# Altium project ECU rev B.PrjPcb (part 2 of 2)

## Sheet ExternalIO.SchDoc
size A4; Organization: Altium Limited; Address1: L3, 12a Rodborough Rd; Address2: Frenchs Forest; Address3: NSW; Address4: Australia 2086
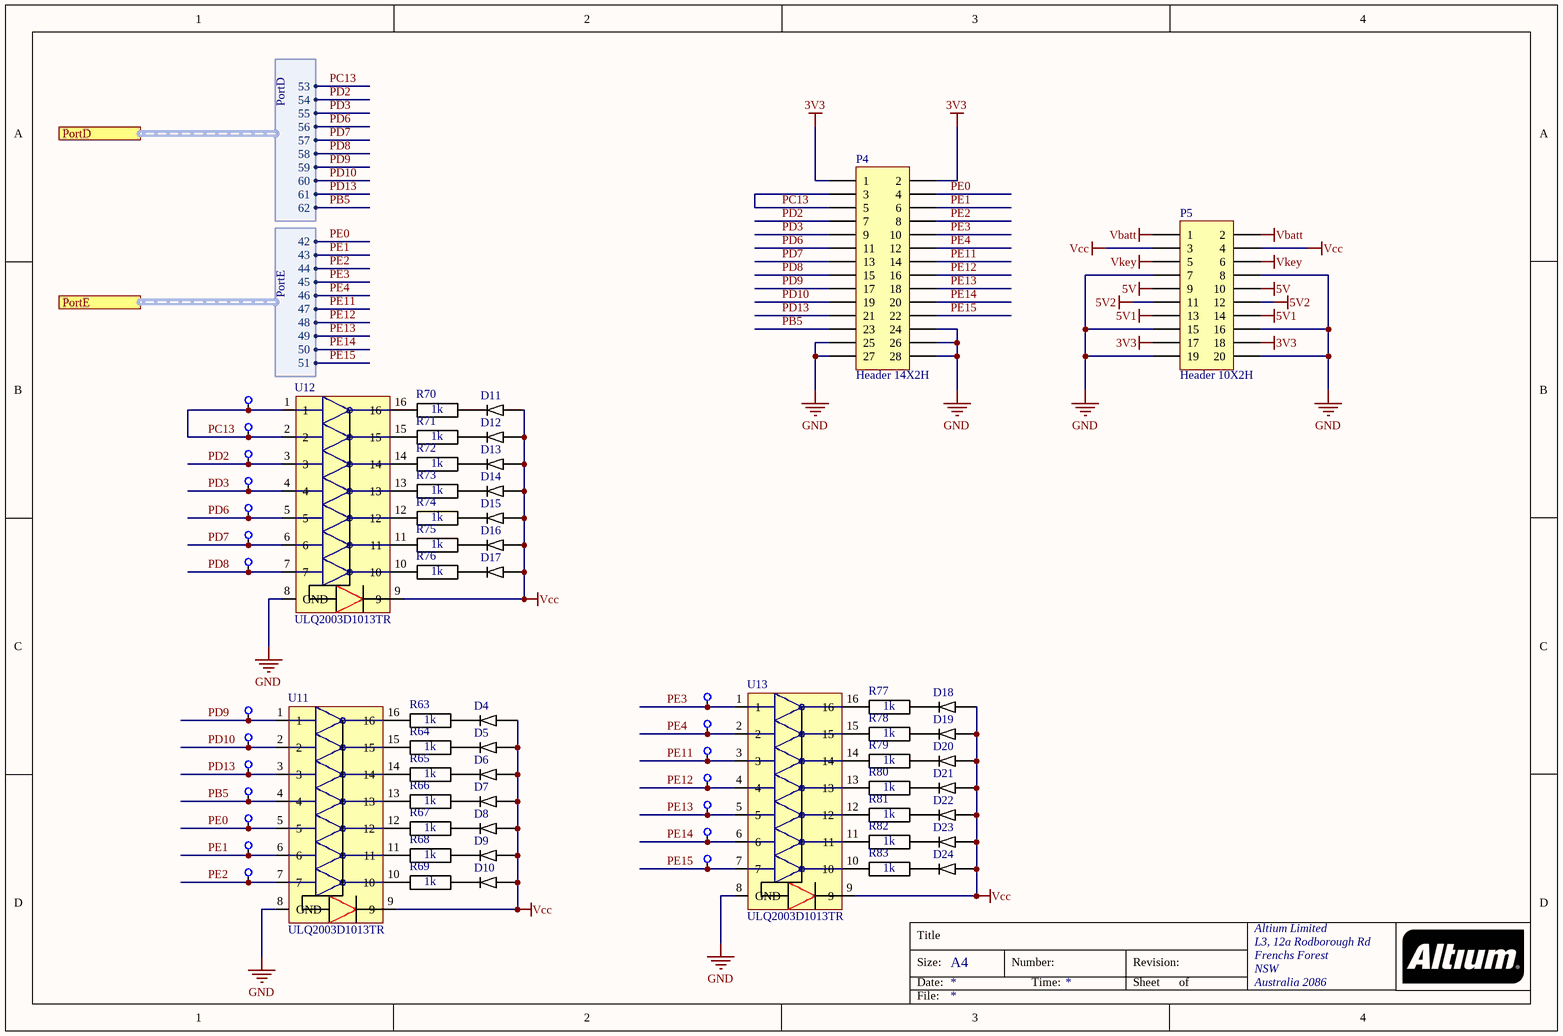
[diagram p16: ExternalIO.SchDoc]

### Parts
D4  LED  [LED 0805]  (value not drawn)
D5  LED  [LED 0805]  (value not drawn)
D6  LED  [LED 0805]  (value not drawn)
D7  LED  [LED 0805]  (value not drawn)
D8  LED  [LED 0805]  (value not drawn)
D9  LED  [LED 0805]  (value not drawn)
D10  LED  [LED 0805]  (value not drawn)
D11  LED  [LED 0805]  (value not drawn)
D12  LED  [LED 0805]  (value not drawn)
D13  LED  [LED 0805]  (value not drawn)
D14  LED  [LED 0805]  (value not drawn)
D15  LED  [LED 0805]  (value not drawn)
D16  LED  [LED 0805]  (value not drawn)
D17  LED  [LED 0805]  (value not drawn)
D18  LED  [LED 0805]  (value not drawn)
D19  LED  [LED 0805]  (value not drawn)
D20  LED  [LED 0805]  (value not drawn)
D21  LED  [LED 0805]  (value not drawn)
D22  LED  [LED 0805]  (value not drawn)
D23  LED  [LED 0805]  (value not drawn)
D24  LED  [LED 0805]  (value not drawn)
P4  Header 14X2H  [HDR2X14H]
P5  Header 10X2H  [HDR2X10H]
R63  1k  [SMD 0805]
R64  1k  [SMD 0805]
R65  1k  [SMD 0805]
R66  1k  [SMD 0805]
R67  1k  [SMD 0805]
R68  1k  [SMD 0805]
R69  1k  [SMD 0805]
R70  1k  [SMD 0805]
R71  1k  [SMD 0805]
R72  1k  [SMD 0805]
R73  1k  [SMD 0805]
R74  1k  [SMD 0805]
R75  1k  [SMD 0805]
R76  1k  [SMD 0805]
R77  1k  [SMD 0805]
R78  1k  [SMD 0805]
R79  1k  [SMD 0805]
R80  1k  [SMD 0805]
R81  1k  [SMD 0805]
R82  1k  [SMD 0805]
R83  1k  [SMD 0805]
TP69  TestPoint  [TESTPOINT]  (value not drawn)
TP70  TestPoint  [TESTPOINT]  (value not drawn)
TP71  TestPoint  [TESTPOINT]  (value not drawn)
TP72  TestPoint  [TESTPOINT]  (value not drawn)
TP73  TestPoint  [TESTPOINT]  (value not drawn)
TP74  TestPoint  [TESTPOINT]  (value not drawn)
TP75  TestPoint  [TESTPOINT]  (value not drawn)
TP76  TestPoint  [TESTPOINT]  (value not drawn)
TP77  TestPoint  [TESTPOINT]  (value not drawn)
TP78  TestPoint  [TESTPOINT]  (value not drawn)
TP79  TestPoint  [TESTPOINT]  (value not drawn)
TP80  TestPoint  [TESTPOINT]  (value not drawn)
TP81  TestPoint  [TESTPOINT]  (value not drawn)
TP82  TestPoint  [TESTPOINT]  (value not drawn)
TP83  TestPoint  [TESTPOINT]  (value not drawn)
TP84  TestPoint  [TESTPOINT]  (value not drawn)
TP85  TestPoint  [TESTPOINT]  (value not drawn)
TP86  TestPoint  [TESTPOINT]  (value not drawn)
TP87  TestPoint  [TESTPOINT]  (value not drawn)
TP88  TestPoint  [TESTPOINT]  (value not drawn)
TP89  TestPoint  [TESTPOINT]  (value not drawn)
U11  ULQ2003D1013TR  [SOIC127P600X175_HS-17M]
U12  ULQ2003D1013TR  [SOIC127P600X175_HS-17M]
U13  ULQ2003D1013TR  [SOIC127P600X175_HS-17M]

### Ports
PortD (harness PortD), PortE (harness PortE)

### Harnesses
PortD: 53, 54, 55, 56, 57, 58, 59, 60, 61, 62
PortE: 42, 43, 44, 45, 46, 47, 48, 49, 50, 51

### Nets
3V3: P4.1 P4.2 P5.17 P5.18
5V: P5.9 P5.10
5V1: P5.13 P5.14
5V2: P5.11 P5.12
GND: P4.24 P4.25 P4.26 P4.27 P4.28 P5.7 P5.8 P5.15 P5.16 P5.19 P5.20 U11.8(GND) U12.8(GND) U13.8(GND)
Vbatt: P5.1 P5.2
Vcc: D4.+ D5.+ D6.+ D7.+ D8.+ D9.+ D10.+ D11.+ D12.+ D13.+ D14.+ D15.+ D16.+ D17.+ D18.+ D19.+ D20.+ D21.+ D22.+ D23.+ D24.+ P5.3 P5.4 U11.9 U12.9 U13.9
Vkey: P5.5 P5.6
PB5: P4.23 TP79.0 U11.4 ; port PortD.62
PC13: P4.3 P4.5 TP69.0 TP70.0 U12.1 U12.2 ; port PortD.53
PD2: P4.7 TP71.0 U12.3 ; port PortD.54
PD3: P4.9 TP72.0 U12.4 ; port PortD.55
PD6: P4.11 TP73.0 U12.5 ; port PortD.56
PD7: P4.13 TP74.0 U12.6 ; port PortD.57
PD8: P4.15 TP75.0 U12.7 ; port PortD.58
PD9: P4.17 TP76.0 U11.1 ; port PortD.59
PD10: P4.19 TP77.0 U11.2 ; port PortD.60
PD13: P4.21 TP78.0 U11.3 ; port PortD.61
PE0: P4.4 TP80.0 U11.5 ; port PortE.42
PE1: P4.6 TP81.0 U11.6 ; port PortE.43
PE2: P4.8 TP82.0 U11.7 ; port PortE.44
PE3: P4.10 TP83.0 U13.1 ; port PortE.45
PE4: P4.12 TP84.0 U13.2 ; port PortE.46
PE11: P4.14 TP85.0 U13.3 ; port PortE.47
PE12: P4.16 TP86.0 U13.4 ; port PortE.48
PE13: P4.18 TP87.0 U13.5 ; port PortE.49
PE14: P4.20 TP88.0 U13.6 ; port PortE.50
PE15: P4.22 TP89.0 U13.7 ; port PortE.51
NetD4_-: D4.- R63.2
NetD5_-: D5.- R64.2
NetD6_-: D6.- R65.2
NetD7_-: D7.- R66.2
NetD8_-: D8.- R67.2
NetD9_-: D9.- R68.2
NetD10_-: D10.- R69.2
NetD11_-: D11.- R70.2
NetD12_-: D12.- R71.2
NetD13_-: D13.- R72.2
NetD14_-: D14.- R73.2
NetD15_-: D15.- R74.2
NetD16_-: D16.- R75.2
NetD17_-: D17.- R76.2
NetD18_-: D18.- R77.2
NetD19_-: D19.- R78.2
NetD20_-: D20.- R79.2
NetD21_-: D21.- R80.2
NetD22_-: D22.- R81.2
NetD23_-: D23.- R82.2
NetD24_-: D24.- R83.2
NetR63_1: R63.1 U11.16
NetR64_1: R64.1 U11.15
NetR65_1: R65.1 U11.14
NetR66_1: R66.1 U11.13
NetR67_1: R67.1 U11.12
NetR68_1: R68.1 U11.11
NetR69_1: R69.1 U11.10
NetR70_1: R70.1 U12.16
NetR71_1: R71.1 U12.15
NetR72_1: R72.1 U12.14
NetR73_1: R73.1 U12.13
NetR74_1: R74.1 U12.12
NetR75_1: R75.1 U12.11
NetR76_1: R76.1 U12.10
NetR77_1: R77.1 U13.16
NetR78_1: R78.1 U13.15
NetR79_1: R79.1 U13.14
NetR80_1: R80.1 U13.13
NetR81_1: R81.1 U13.12
NetR82_1: R82.1 U13.11
NetR83_1: R83.1 U13.10

### Notes on the sheet
- Title
- Size:
- Date:
- A4
- Number:
- Time:
- Revision:
- Sheet
- of
- File:

### Library data of the parts
D4-D24 = LED: LTST-C171GKT; pin to pad: +>2 ->1
P4 = Header 14X2H: Header, 14-Pin, Dual row, Right Angle; LatestRevisionDate: 17-Jul-2002; LatestRevisionNote: Re-released for DXP Platform.; Publisher: Altium Limited
P5 = Header 10X2H: Header, 10-Pin, Dual row, Right Angle; LatestRevisionDate: 17-Jul-2002; LatestRevisionNote: Re-released for DXP Platform.; Publisher: Altium Limited
R63-R83 = Resistor: RC0805FR-071KL; Value: 1k
U11-U13 = ULN2003AIDR

## Nets that join several sheets
3V3: PowerSup (41 pins), HIP9011 (C86.1 U6.1 U6.11), CPU_A (6 pins), ExternalRAM (8 pins), ExternalIO (P4.1 P4.2 P5.17 P5.18)
5V: PowerSup (14 pins), LambdaWide (R31.2), HIP9011 (6 pins), AC1 (C88_AC1.1 C90_AC1.2 D2_AC1.2 U7_AC1.8), AC2 (C88_AC2.1 C90_AC2.2 D2_AC2.2 U7_AC2.8), AC3 (C88_AC3.1 C90_AC3.2 D2_AC3.2 U7_AC3.8), AC4 (C88_AC4.1 C90_AC4.2 D2_AC4.2 U7_AC4.8), AC5 (C88_AC5.1 C90_AC5.2 D2_AC5.2 U7_AC5.8), AC6 (C88_AC6.1 C90_AC6.2 D2_AC6.2 U7_AC6.8), AC7 (C88_AC7.1 C90_AC7.2 D2_AC7.2 U7_AC7.8), AC8 (C88_AC8.1 C90_AC8.2 D2_AC8.2 U7_AC8.8), AC9 (C88_AC9.1 C90_AC9.2 D2_AC9.2 U7_AC9.8), LIN1 (R45_LIN1.1), LIN2 (R45_LIN2.1), ExternalIO (P5.9 P5.10)
5V1: Connector (P1.33), PowerSup (C43.2 C46.2 TP27.0 U2.9), ExternalIO (P5.13 P5.14)
5V2: Connector (P1.32 P1.45), PowerSup (C42.2 C45.2 TP26.0 U2.10), ExternalIO (P5.11 P5.12)
GND: Connector (32 pins), IgnCvt1 (C48_IgnCvt1.1 C49_IgnCvt1.1 Q2_IgnCvt1.3 R7_IgnCvt1.1), IgnCvt2 (C48_IgnCvt2.1 C49_IgnCvt2.1 Q2_IgnCvt2.3 R7_IgnCvt2.1), IgnCvt3 (C48_IgnCvt3.1 C49_IgnCvt3.1 Q2_IgnCvt3.3 R7_IgnCvt3.1), IgnCvt4 (C48_IgnCvt4.1 C49_IgnCvt4.1 Q2_IgnCvt4.3 R7_IgnCvt4.1), StepDrive (C53.1 C54.1 C55.1 C56.1), Interface (C50.1 C51.1 C52.1 U4.3), OP1 (C57_OP1.1 VD_OP1.2), OP2 (C57_OP2.1 VD_OP2.2), OP3 (C57_OP3.1 VD_OP3.2), OP4 (C57_OP4.1 VD_OP4.2), OP5 (C57_OP5.1 VD_OP5.2), OP6 (C57_OP6.1 VD_OP6.2), OP7 (C57_OP7.1 VD_OP7.2), OP8 (C57_OP8.1 VD_OP8.2), OP9 (C57_OP9.1 VD_OP9.2), OP10 (C57_OP10.1 VD_OP10.2), OP11 (C57_OP11.1 VD_OP11.2), OP12 (C57_OP12.1 VD_OP12.2), PowerSup (72 pins), VRS (6 pins), LambdaWide (7 pins), DC1 (C77_DC1.1 D1_DC1.- Q6_DC1.2), DC2 (C77_DC2.1 D1_DC2.- Q6_DC2.2), DC3 (C77_DC3.1 D1_DC3.- Q6_DC3.2), DC4 (C77_DC4.1 D1_DC4.- Q6_DC4.2), DC5 (C77_DC5.1 D1_DC5.- Q6_DC5.2), HIP9011 (10 pins), AC1 (11 pins), AC2 (11 pins), AC3 (11 pins), AC4 (11 pins), AC5 (11 pins), AC6 (11 pins), AC7 (11 pins), Convert12to5 (R44.2 R44.4), AC8 (11 pins), AC9 (11 pins), LIN1 (C93_LIN1.1 C94_LIN1.2 R46_LIN1.2), LIN2 (C93_LIN2.1 C94_LIN2.2 R46_LIN2.2), TaxoOut (Q7.3), CPU_A (18 pins), ExternalRAM (8 pins), ExternalIO (14 pins)
Vbatt: Connector (P1.12), Interface (R9.2), OP1 (VD5_OP1.1), OP2 (VD5_OP2.1), OP3 (VD5_OP3.1), OP4 (VD5_OP4.1), OP5 (VD5_OP5.1), OP6 (VD5_OP6.1), OP7 (VD5_OP7.1), OP8 (VD5_OP8.1), OP9 (VD5_OP9.1), OP10 (VD5_OP10.1), OP11 (VD5_OP11.1), OP12 (VD5_OP12.1), PowerSup (R2.2 TP18.0 VD2.0), DC1 (VD6_DC1.1), DC2 (VD6_DC2.1), DC3 (VD6_DC3.1), DC4 (VD6_DC4.1), DC5 (VD6_DC5.1), AC1 (VD7_AC1.1), AC2 (VD7_AC2.1), AC3 (VD7_AC3.1), AC4 (VD7_AC4.1), AC5 (VD7_AC5.1), AC6 (VD7_AC6.1), AC7 (VD7_AC7.1), AC8 (VD7_AC8.1), AC9 (VD7_AC9.1), TaxoOut (R49.2 VD8.1), ExternalIO (P5.1 P5.2)
Vcc: PowerSup (6 pins), ExternalIO (26 pins)
Vkey: Connector (P1.13), PowerSup (TP19.0 VD3.0), CPU_A (U2.11), ExternalIO (P5.5 P5.6)
Vmain: Connector (P1.44 P1.63), Convert12to5 (R44.1)
VUSB: PowerSup (C30.2 U1.90), CPU_A (C102.1 P3.1 R62.1 U9.5)
~{CS}: HIP9011 (U6.8), CPU_A (R53.13)
~{L9CS}: Interface (U2.53), CPU_A (R54.9)
~{LmCS}: Interface (U3.18), CPU_A (R55.10)
~{RESET}: Connector (U2.5), CPU_A (C95.1 U1.27)
Absorber: Connector (P1.46 TP8.0 U2.24), OP8 (C57_OP8.2 VD5_OP8.0 VD_OP8.1)
Air Temp sensor: Connector (P1.40), AC7 (C87_AC7.2 R41_AC7.1 TP59_AC7.0 VD7_AC7.0)
AirT: AC7 (C92_AC7.2 D3_AC7.+ R43_AC7.2 TP63_AC7.0), CPU_A (U1.24)
ALE: CPU_A (U1.82), ExternalRAM (U10.17)
CAN_H: Connector (P1.72), Interface (R11.2 TP31.0 U2.42 U4.2)
CAN_L: Connector (P1.73), Interface (R10.2 TP32.0 U2.41 U4.1)
CE_lamp: Connector (P1.31 TP12.0 U2.40), OP12 (C57_OP12.2 VD5_OP12.0 VD_OP12.1)
CLE: CPU_A (U1.81), ExternalRAM (U10.16)
Coil1: Connector (P1.5), IgnCvt1 (C49_IgnCvt1.2 Q2_IgnCvt1.4 TP30_IgnCvt1.0)
Coil2: Connector (P1.1), IgnCvt2 (C49_IgnCvt2.2 Q2_IgnCvt2.4 TP30_IgnCvt2.0)
Coil3: Connector (P1.2), IgnCvt3 (C49_IgnCvt3.2 Q2_IgnCvt3.4 TP30_IgnCvt3.0)
Coil4: Connector (P1.4), IgnCvt4 (C49_IgnCvt4.2 Q2_IgnCvt4.4 TP30_IgnCvt4.0)
ConditD: DC4 (Q6_DC4.3 TP52_DC4.0), CPU_A (R56.14)
Conditioner: Connector (P1.69 TP9.0 U2.32), OP9 (C57_OP9.2 VD5_OP9.0 VD_OP9.1)
Conditioner sensor: Connector (P1.76), DC4 (C77_DC4.2 R33_DC4.1 TP50_DC4.0 VD6_DC4.0)
Coolant Temp sensor: Connector (P1.39), AC6 (C87_AC6.2 R41_AC6.1 TP59_AC6.0 VD7_AC6.0)
CoolantT: AC6 (C92_AC6.2 D3_AC6.+ R43_AC6.2 TP63_AC6.0), CPU_A (U1.28)
CPS_N: Connector (P1.34), VRS (6 pins)
CPS_P: Connector (P1.15), VRS (7 pins)
ESF D: DC3 (Q6_DC3.3 TP52_DC3.0), CPU_A (R56.15)
ESF sensor: Connector (P1.75), DC3 (C77_DC3.2 R33_DC3.1 TP50_DC3.0 VD6_DC3.0)
FAN1: Connector (P1.68 TP2.0 U2.31), OP2 (C57_OP2.2 VD5_OP2.0 VD_OP2.1)
FAN2: Connector (P1.29 TP3.0 U2.54), OP3 (C57_OP3.2 VD5_OP3.0 VD_OP3.1)
FMC_D0: CPU_A (U1.84), ExternalRAM (U10.29)
FMC_D1: CPU_A (U1.85), ExternalRAM (U10.30)
FMC_D2: CPU_A (U1.112), ExternalRAM (U10.31)
FMC_D3: CPU_A (U1.113), ExternalRAM (U10.32)
FMC_D4: CPU_A (U1.57), ExternalRAM (U10.41)
FMC_D5: CPU_A (U1.58), ExternalRAM (U10.42)
FMC_D6: CPU_A (U1.59), ExternalRAM (U10.43)
FMC_D7: CPU_A (U1.60), ExternalRAM (U10.44)
Fuel press: Connector (P1.70 TP7.0 U2.30), OP7 (C57_OP7.2 VD5_OP7.0 VD_OP7.1)
FuelG: Connector (P1.10 TP10.0 U2.55), OP10 (C57_OP10.2 VD5_OP10.0 VD_OP10.1)
HIP in: AC1 (C92_AC1.2 D3_AC1.+ R43_AC1.2 TP63_AC1.0), CPU_A (U1.29)
HIP INT: HIP9011 (U6.18), CPU_A (R53.9)
HIP SCK: HIP9011 (U6.12), CPU_A (R53.12)
HIP sensor: HIP9011 (TP53.0 U5.4), AC1 (C87_AC1.2 R41_AC1.1 TP59_AC1.0 VD7_AC1.0)
HIP SI: HIP9011 (U6.16), CPU_A (R53.10)
HIP SO: HIP9011 (U6.14), CPU_A (R53.11)
Ign1: Connector (U2.22), IgnCvt1 (C48_IgnCvt1.2 Q2_IgnCvt1.1 R7_IgnCvt1.2 TP29_IgnCvt1.0)
Ign2: Connector (U2.62), IgnCvt2 (C48_IgnCvt2.2 Q2_IgnCvt2.1 R7_IgnCvt2.2 TP29_IgnCvt2.0)
Ign3: Connector (U2.63), IgnCvt3 (C48_IgnCvt3.2 Q2_IgnCvt3.1 R7_IgnCvt3.2 TP29_IgnCvt3.0)
Ign4: Connector (U2.64), IgnCvt4 (C48_IgnCvt4.2 Q2_IgnCvt4.1 R7_IgnCvt4.2 TP29_IgnCvt4.0)
K-line: Connector (P1.71), Interface (C51.2 R9.1 TP33.0 U2.45)
KnockS1: Connector (P1.19), HIP9011 (C78.2)
KnockS2: Connector (P1.21), HIP9011 (C79.2)
L9DIN: Interface (U2.50), CPU_A (R54.12)
L9DO: Interface (U2.52), CPU_A (R54.10)
L9SCK: Interface (U2.51), CPU_A (R54.11)
Lambda1: AC8 (C92_AC8.2 D3_AC8.+ R43_AC8.2 TP63_AC8.0), CPU_A (U1.30)
Lambda2: AC9 (C92_AC9.2 D3_AC9.+ R43_AC9.2 TP63_AC9.0), CPU_A (U1.31)
Lambda sensor: Connector (P1.18), LIN1 (5 pins)
Lambda sensor 2: Interface (R8.1 U3.31), LIN2 (5 pins)
LmPW: Interface (U3.14), CPU_A (R55.14)
LmSCK: Interface (U3.16), CPU_A (R55.12)
LmSI: Interface (U3.17), CPU_A (R55.11)
LmSO: Interface (U3.15), CPU_A (R55.13)
LmSY: Interface (U3.13), CPU_A (R55.15)
MAF: AC4 (C92_AC4.2 D3_AC4.+ R43_AC4.2 TP63_AC4.0), CPU_A (U1.52)
MAF sensor: Connector (P1.37), AC4 (C87_AC4.2 R41_AC4.1 TP59_AC4.0 VD7_AC4.0)
MainVoltage: AC3 (C92_AC3.2 D3_AC3.+ R43_AC3.2 TP63_AC3.0), CPU_A (U1.48)
MAP: AC5 (C92_AC5.2 D3_AC5.+ R43_AC5.2 TP63_AC5.0), CPU_A (U1.53)
MAP sensor: Connector (P1.38), AC5 (C87_AC5.2 R41_AC5.1 TP59_AC5.0 VD7_AC5.0)
MRD: Connector (P1.14 TP1.0 VD1.0), OP1 (C57_OP1.2 VD5_OP1.0 VD_OP1.1)
NCE: CPU_A (U1.95), ExternalRAM (U10.9)
NetC87_AC3_2: Connector (TP17.0), AC3 (C87_AC3.2 R41_AC3.1 TP59_AC3.0 VD7_AC3.0), Convert12to5 (R44.5 R44.6 R44.7 R44.8)
NetC87_AC8_2: AC8 (C87_AC8.2 R41_AC8.1 TP59_AC8.0 VD7_AC8.0), LIN1 (C94_LIN1.1 R47_LIN1.2 TP65_LIN1.0)
NetC87_AC9_2: AC9 (C87_AC9.2 R41_AC9.1 TP59_AC9.0 VD7_AC9.0), LIN2 (C94_LIN2.1 R47_LIN2.2 TP65_LIN2.0)
NOE: CPU_A (U1.116), ExternalRAM (U10.8)
NWAIT: CPU_A (U1.93), ExternalRAM (U10.7)
NWE: CPU_A (U1.117), ExternalRAM (U10.18)
O2 Heater1: Connector (P1.48 TP4.0 U2.56), OP4 (C57_OP4.2 VD5_OP4.0 VD_OP4.1)
O2 Heater2: Connector (P1.28 TP5.0 U2.29), OP5 (C57_OP5.2 VD5_OP5.0 VD_OP5.1), LambdaWide (Q5.4 R27.1 R28.1)
O2 Pump: Connector (P1.23), LambdaWide (Q3.4 Q4.4 R17.2 TP45.0)
O2 Ref: Connector (P1.22), LambdaWide (6 pins)
O2 Tag: Connector (P1.24), LambdaWide (R20.2 R21.2 TP44.0)
PB5: CPU_A (U1.132), ExternalIO (P4.23 TP79.0 U11.4)
PC13: CPU_A (U1.9), ExternalIO (6 pins)
PD2: CPU_A (U1.114), ExternalIO (P4.7 TP71.0 U12.3)
PD3: CPU_A (U1.115), ExternalIO (P4.9 TP72.0 U12.4)
PD6: CPU_A (U1.120), ExternalIO (P4.11 TP73.0 U12.5)
PD7: CPU_A (U1.121), ExternalIO (P4.13 TP74.0 U12.6)
PD8: CPU_A (U1.76), ExternalIO (P4.15 TP75.0 U12.7)
PD9: CPU_A (U1.77), ExternalIO (P4.17 TP76.0 U11.1)
PD10: CPU_A (U1.78), ExternalIO (P4.19 TP77.0 U11.2)
PD13: CPU_A (U1.83), ExternalIO (P4.21 TP78.0 U11.3)
PE0: CPU_A (U1.138), ExternalIO (P4.4 TP80.0 U11.5)
PE1: CPU_A (U1.139), ExternalIO (P4.6 TP81.0 U11.6)
PE2: CPU_A (U1.1), ExternalIO (P4.8 TP82.0 U11.7)
PE3: CPU_A (U1.2), ExternalIO (P4.10 TP83.0 U13.1)
PE4: CPU_A (U1.3), ExternalIO (P4.12 TP84.0 U13.2)
PE11: CPU_A (U1.61), ExternalIO (P4.14 TP85.0 U13.3)
PE12: CPU_A (U1.62), ExternalIO (P4.16 TP86.0 U13.4)
PE13: CPU_A (U1.63), ExternalIO (P4.18 TP87.0 U13.5)
PE14: CPU_A (U1.64), ExternalIO (P4.20 TP88.0 U13.6)
PE15: CPU_A (U1.65), ExternalIO (P4.22 TP89.0 U13.7)
Phase sensor: Connector (P1.79), DC5 (C77_DC5.2 R33_DC5.1 TP50_DC5.0 VD6_DC5.0)
PhaseD: DC5 (Q6_DC5.3 TP52_DC5.0), CPU_A (R56.11)
RAM WP: CPU_A (U1.54), ExternalRAM (U10.19)
RX_CAN: Interface (U2.43), CPU_A (R54.16)
RX_Kl: Interface (U2.46), CPU_A (R54.14)
Select sensor: Connector (P1.57), DC1 (C77_DC1.2 R33_DC1.1 TP50_DC1.0 VD6_DC1.0)
SelectD: DC1 (Q6_DC1.3 TP52_DC1.0), CPU_A (R56.13)
Speed sensor: Connector (P1.59), DC2 (C77_DC2.2 R33_DC2.1 TP50_DC2.0 VD6_DC2.0)
SpeedD: DC2 (Q6_DC2.3 TP52_DC2.0), CPU_A (R56.12)
Starter: Connector (P1.50 TP6.0 U2.57), OP6 (C57_OP6.2 VD5_OP6.0 VD_OP6.1)
Step phase A: Connector (P1.67), StepDrive (C56.2 TP34.0 U2.13)
Step phase B: Connector (P1.66), StepDrive (C55.2 TP35.0 U2.16)
Step phase C: Connector (P1.65), StepDrive (C54.2 TP36.0 U2.17)
Step phase D: Connector (P1.64), StepDrive (C53.2 TP37.0 U2.20)
Taxo: Connector (P1.8 TP11.0), OP11 (C57_OP11.2 VD5_OP11.0 VD_OP11.1), TaxoOut (Q7.4 R49.1 TP68.0 VD8.0)
TaxoOut: TaxoOut (R48.2 TP66.0), CPU_A (R57.12)
TPS: AC2 (C92_AC2.2 D3_AC2.+ R43_AC2.2 TP63_AC2.0), CPU_A (U1.47)
TPS sensor: Connector (P1.16), AC2 (C87_AC2.2 R41_AC2.1 TP59_AC2.0 VD7_AC2.0)
TX_CAN: Interface (U2.44), CPU_A (R54.15)
TX_Kl: Interface (U2.47), CPU_A (R54.13)
VRS: VRS (TP42.0 U2.8), CPU_A (R57.11)
WDA: Connector (U2.38), CPU_A (R58.9)
WLS in: Connector (P1.55), LambdaWide (5 pins)